# Altium schematic sheet chess_module_HEF.SchDoc
size A; SheetNumber: 2; SheetTotal: 3
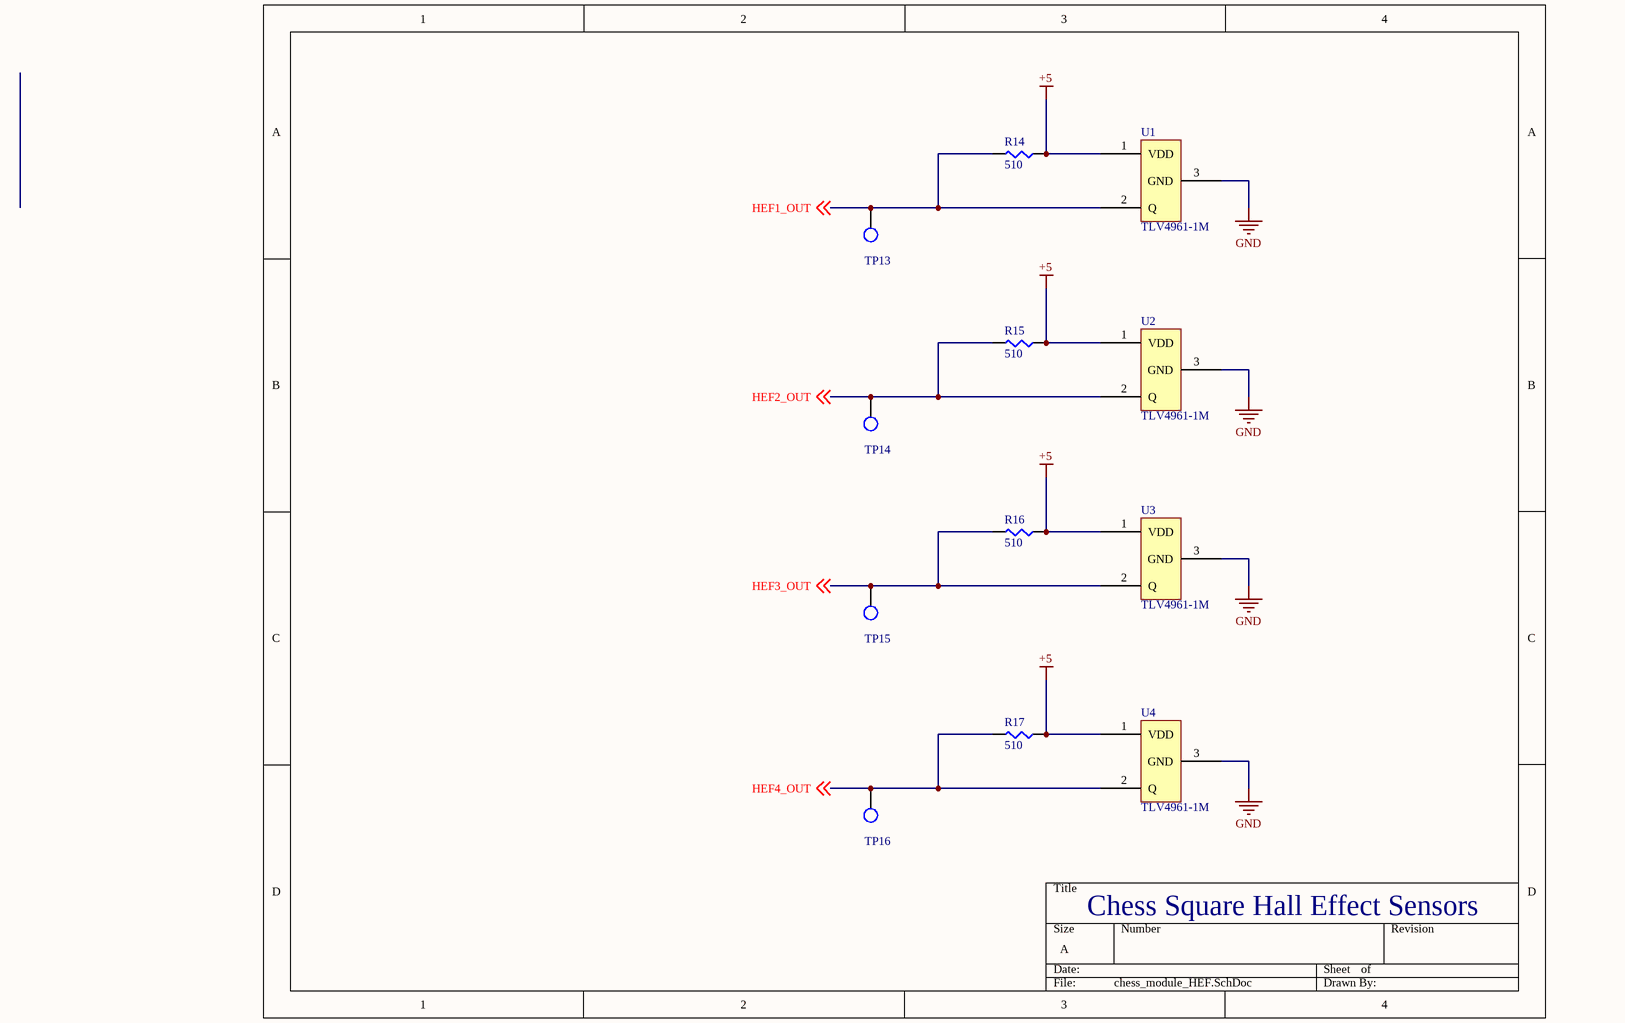
[diagram p0: chess_module_HEF.SchDoc]

## Parts
R14  510  [SMD-0805-RES]
R15  510  [SMD-0805-RES]
R16  510  [SMD-0805-RES]
R17  510  [SMD-0805-RES]
TP13  TP_1206  [TP-SMC-1206]  (value not drawn)
TP14  TP_1206  [TP-SMC-1206]  (value not drawn)
TP15  TP_1206  [TP-SMC-1206]  (value not drawn)
TP16  TP_1206  [TP-SMC-1206]  (value not drawn)
U1  TLV4961-1M  [SOT95P245X110-3N]
U2  TLV4961-1M  [SOT95P245X110-3N]
U3  TLV4961-1M  [SOT95P245X110-3N]
U4  TLV4961-1M  [SOT95P245X110-3N]

## Nets
+5: R14.1 R15.1 R16.1 R17.1 U1.1(VDD) U2.1(VDD) U3.1(VDD) U4.1(VDD)
GND: U1.3(GND) U2.3(GND) U3.3(GND) U4.3(GND)
HEF1_OUT: R14.2 TP13.1 U1.2(Q) ; off-sheet HEF1_OUT
HEF2_OUT: R15.2 TP14.1 U2.2(Q) ; off-sheet HEF2_OUT
HEF3_OUT: R16.2 TP15.1 U3.2(Q) ; off-sheet HEF3_OUT
HEF4_OUT: R17.2 TP16.1 U4.2(Q) ; off-sheet HEF4_OUT

## Notes on the sheet
- Chess Square Hall Effect Sensors

## Library data of the parts
R14-R17 = ERJ-6ENF5100V: RES SMD 510 OHM 1% 1/8W 0805; Manufacturer: Panasonic Electronic Components; Factory Stock: 0; Unit Price (USD): 0.00729; @ qty: 1500; Minimum Quantity: 1; Power (Watts): 0.125W, 1/8W; Temperature Coefficient: ±100ppm/°C; Part Number: ERJ-6ENF5100V; Datasheets: http://industrial.panasonic.com/www-cgi/jvcr13pz.cgi?E+PZ+3+AOA0002+ERJ6ENF5100V+7+WW; Image: //media.digikey.com/Renders/Panasonic%20Renders/ERJ-0805%20Pkg.jpg; Digi-Key Part Number: P510CCT-ND; Quantity Available: 80206; Packaging: Cut Tape (CT); Series: ERJ; Part Status: Active; Value: 510; Tolerance: ±1%; Composition: Thick Film; Features: Automotive AEC-Q200; Operating Temperature: -55°C ~ 155°C; Package / Case: 0805 (2012 Metric); Supplier Device Package: 0805; Size / Dimension: 0.079" L x 0.049" W (2.00mm x 1.25mm); Height - Seated (Max): 0.028" (0.70mm); Number of Terminations: 2; Failure Rate: -
TP13-TP16 = TP_1206: Test Point SMD 1206; Manufacturer: TE Connectivity (Tyco Electronics); Manufacturer Part Number: 1625854-1; Resistance Value: 0 Ohm; Temperature Coefficient: N/R; Supplier: Digi-Key; Stock 1: 31937; Pricing 1: 1=0.28, 10=0.261, 25=0.224, 50=0.1902, 100=0.1828, 250=0.1641, 500=0.1567, 1000=0.1306 (USD); Case Size: 1206; Dimension: 3.2 x 1.6 x 1.25mm; Family: RC; Mounting: Surface Mount; Operating Temperature: -55 to 125 C; Part No: 1625854-1; RoHS: Yes; Packaging: Tape and Reel; Termination Style: N/R; Terminal Pitch: N/R; Power Rating: N/R; Tolerance: N/R; ComponentLink1URL: https://datasheet.ciiva.com/6439/eng-ds-1773266-a-6439169.pdf; ComponentLink1Description: https://datasheet.ciiva.com/6439/eng-ds-1773266-a-6439169.pdf; ComponentLink2URL: https://datasheet.ciiva.com/30136/1773266-a-30136341.pdf; ComponentLink2Description: https://datasheet.ciiva.com/30136/1773266-a-30136341.pdf; ComponentLink3URL: https://datasheet.ciiva.com/6439/eng-ds-1773266-a-6439080.pdf; ComponentLink3Description: https://datasheet.ciiva.com/6439/eng-ds-1773266-a-6439080.pdf; ComponentLink4URL: https://datasheet.ciiva.com/6439/eng-ds-1773266-a-6439081.pdf; ComponentLink4Description: https://datasheet.ciiva.com/6439/eng-ds-1773266-a-6439081.pdf; ComponentLink5URL: https://datasheet.ciiva.com/6439/eng-ds-1773266-a-6439083.pdf; ComponentLink5Description: https://datasheet.ciiva.com/6439/eng-ds-1773266-a-6439083.pdf; Supplier Part Number: A106143CT-ND
U1-U4 = TLV4961-1M: Hall Effect Sensor